# EasyEDA Pro project ProPrj_ESP32SoundBoard_2026-02-01.epro, board ESP32SoundBoard_1
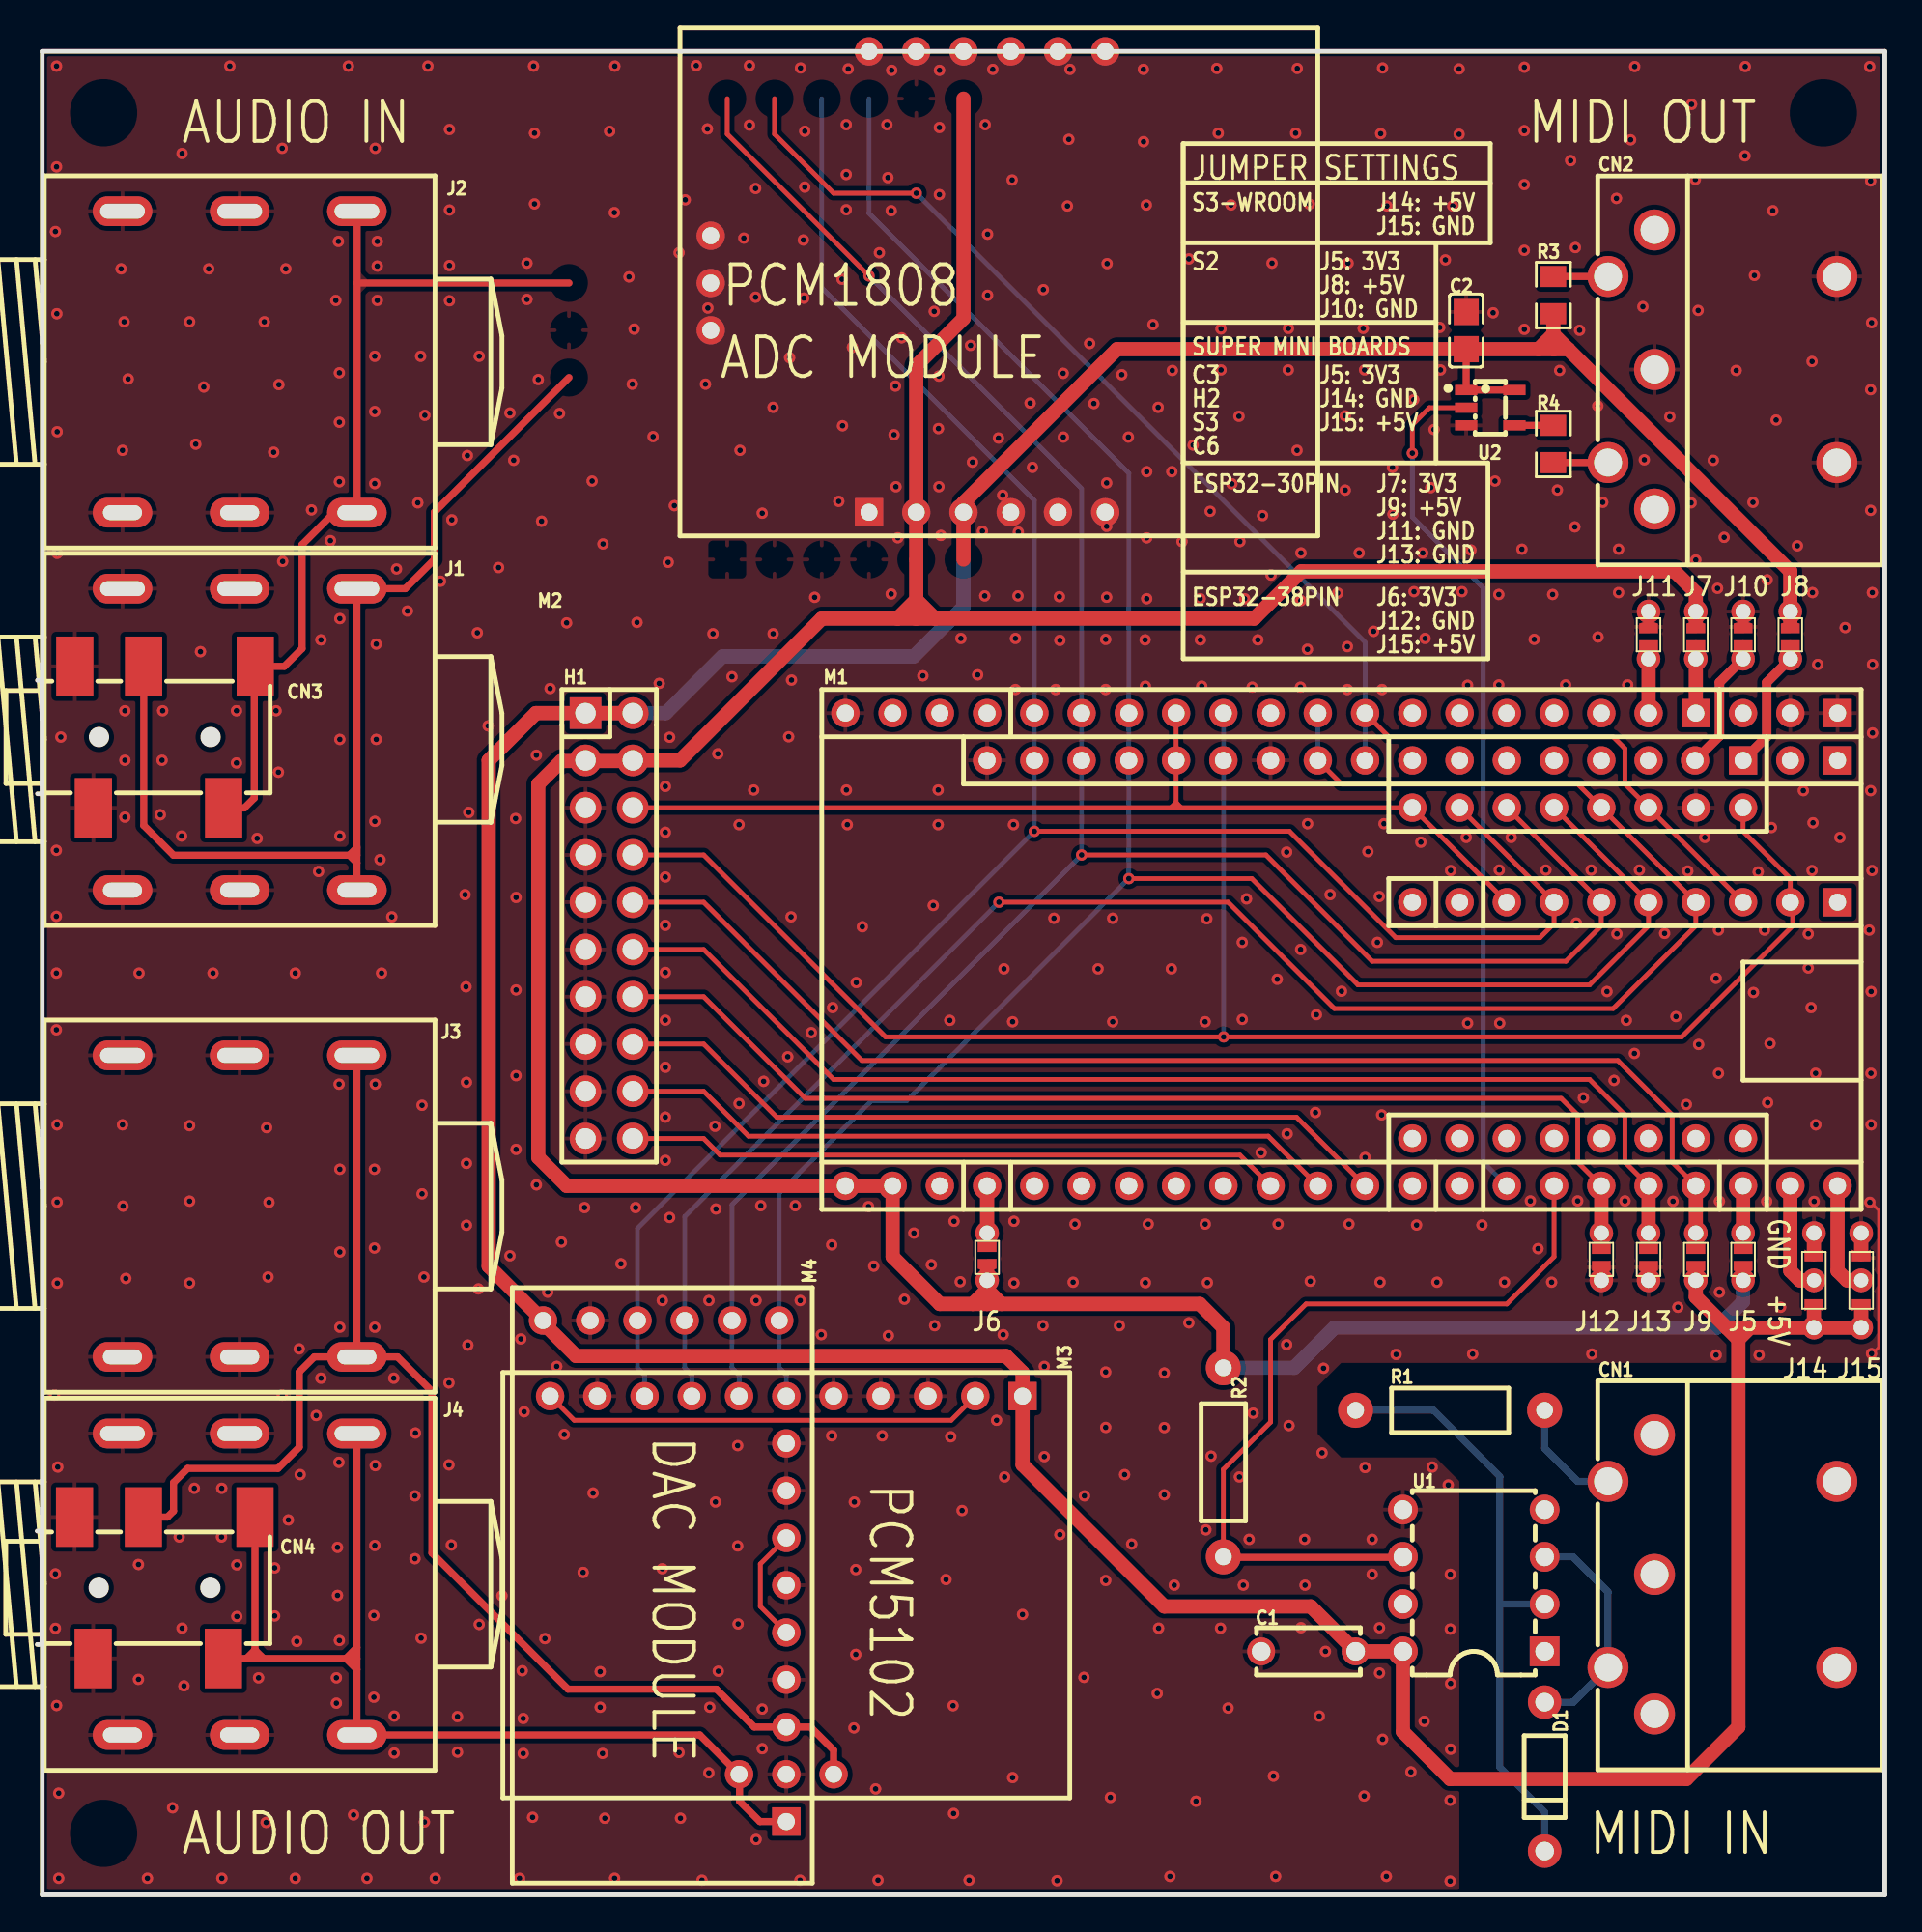
[diagram p6: board, top side]
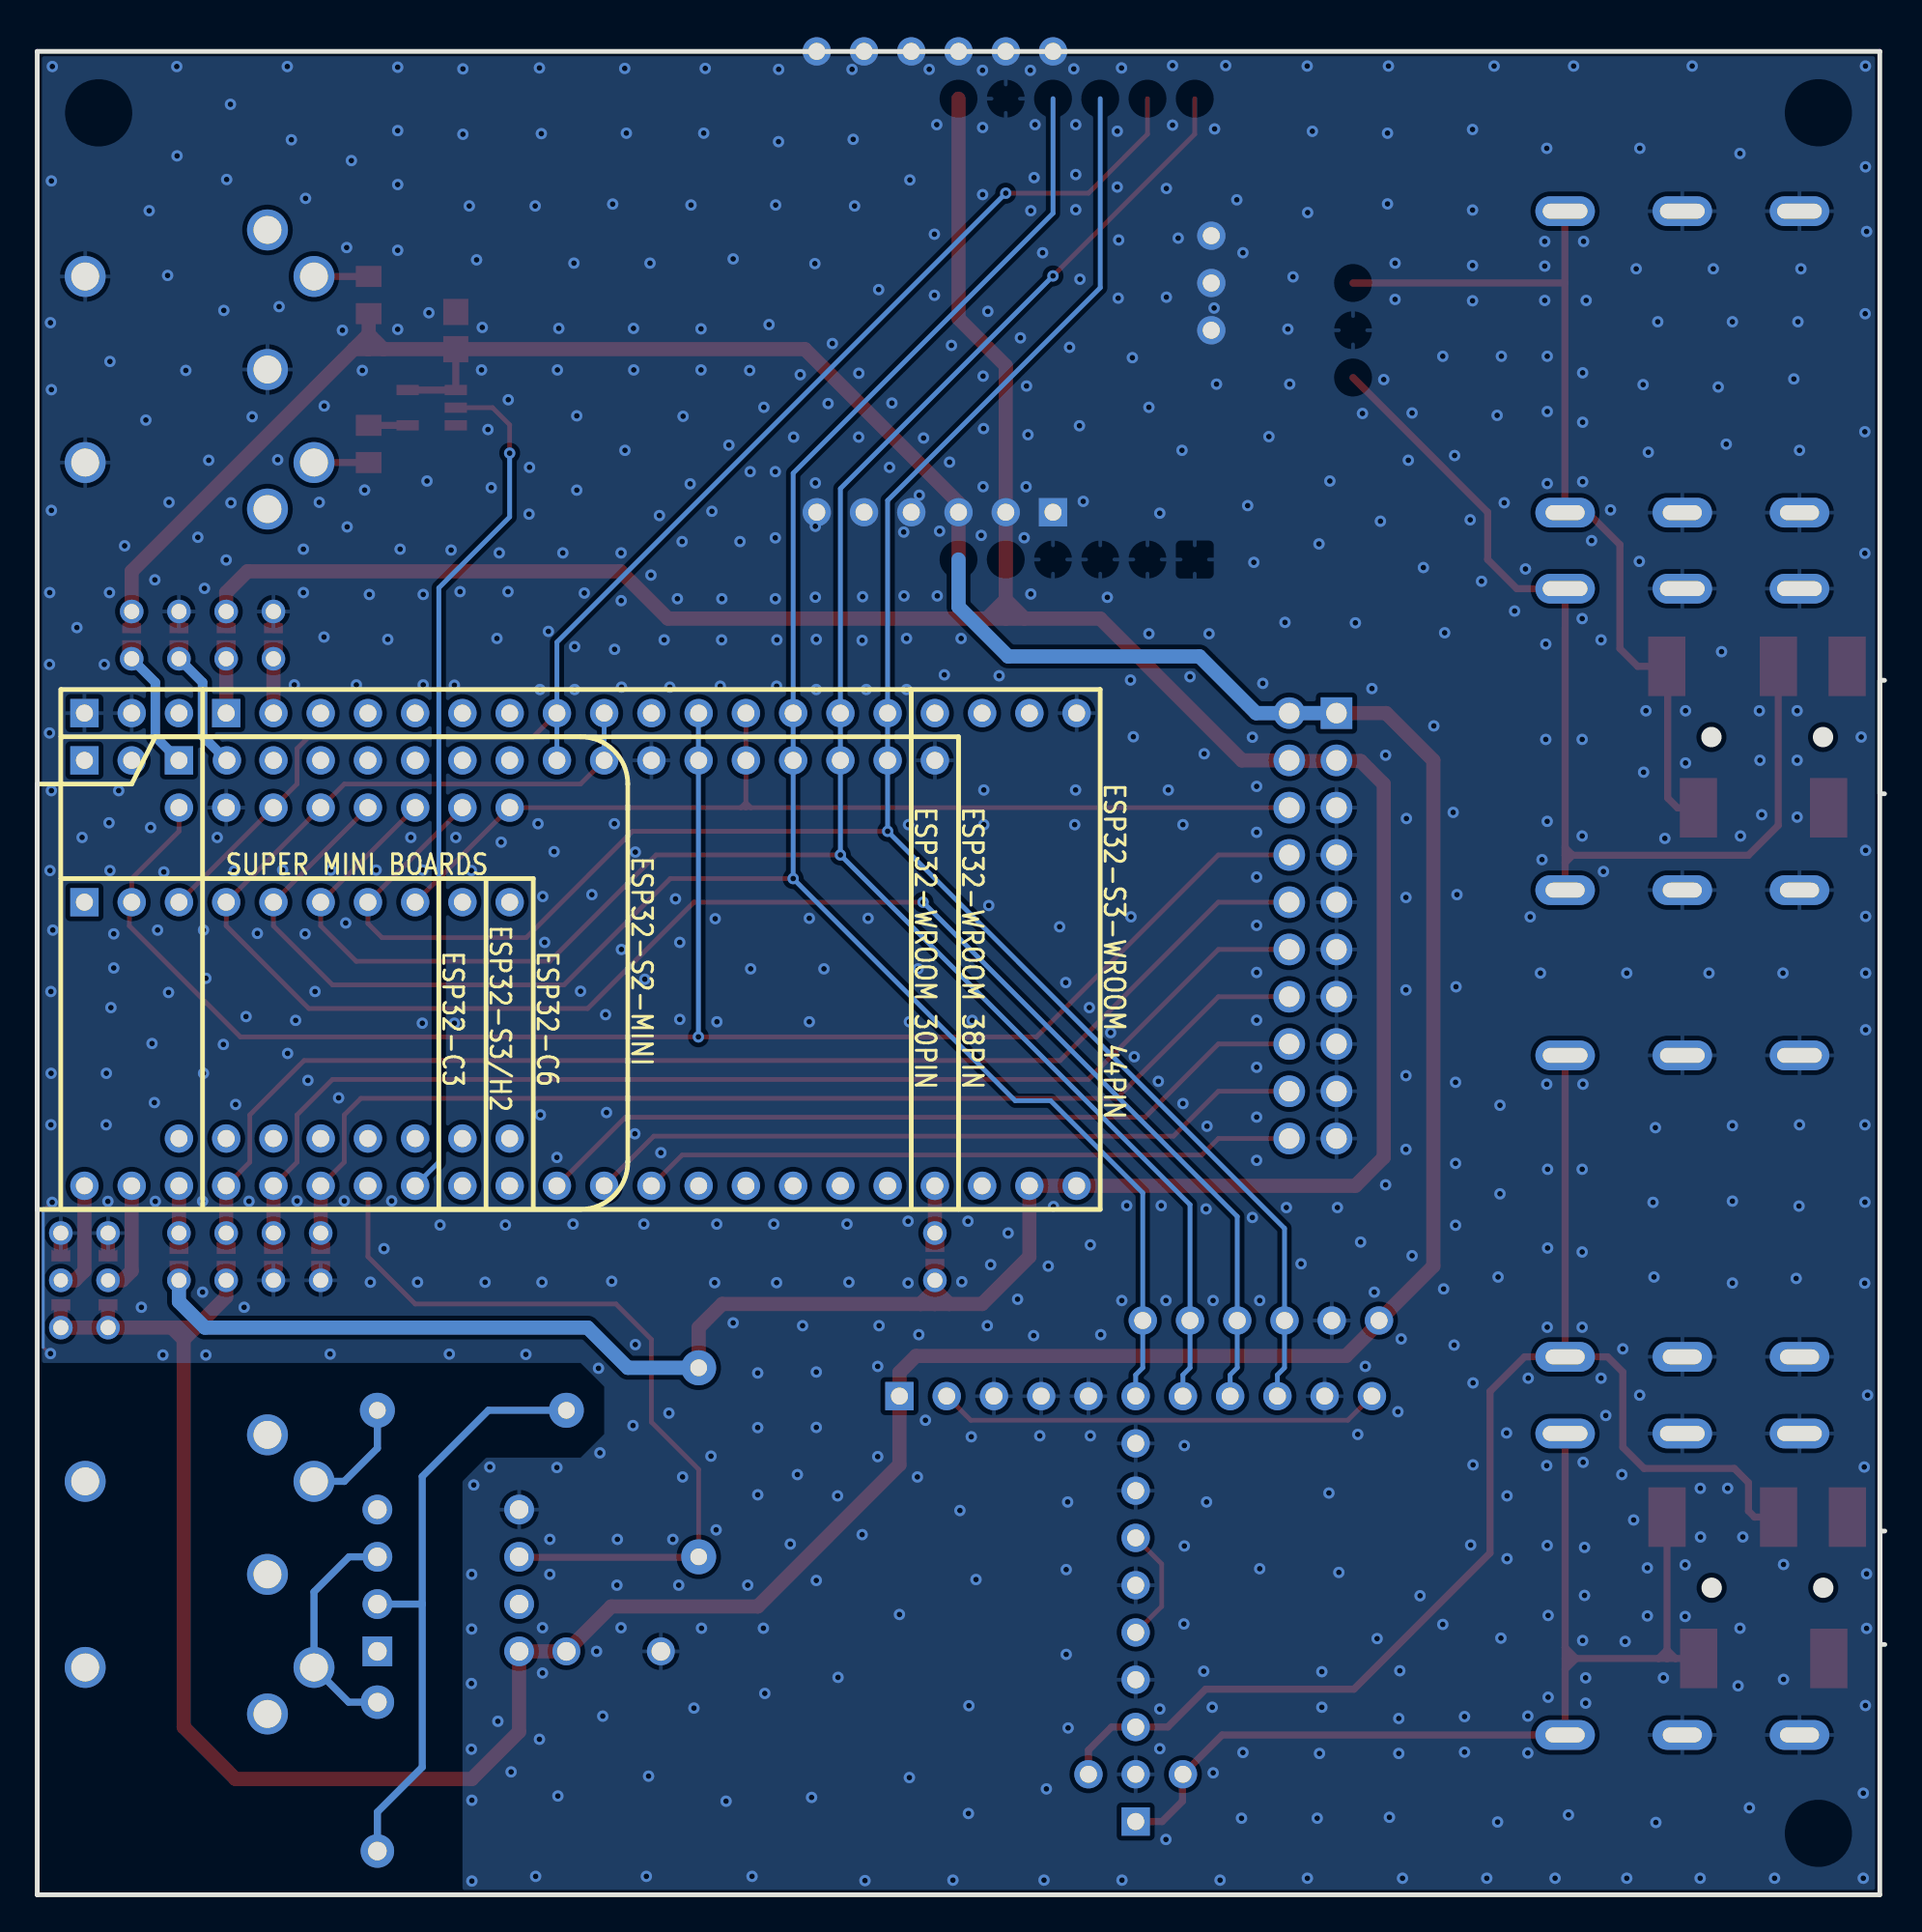
[diagram p7: board, bottom side, seen from below]

Outline 99.33 x 99.06 mm; copper layers: Top Layer, Bottom Layer. Coordinates in mm from the lower left corner of the outline.
Outline path: 0.27,99.06 99.33,99.06 99.33,0 0.27,0 0.27,99.06
Stack: Top Layer 0.035mm / Dielectric1 1.51mm FR4 er 4.5 / Bottom Layer 0.035mm

## Design rules (mm)
template: Custom Config
spacing copperThickness1oz (default): track to track 0.152, other pairs 0.152 to 0.3
spacing copperThickness2oz: track to track 0.203, other pairs 0.152 to 0.3
track width copperThickness1oz (default): min 0.127, default 0.254, max 2.54
track width copperThickness2oz: min 0.203, default 0.254, max 2.54
differential pair differentialPair (default): width min 0.127, default 0.254, max 2.54; gap min 0.152, default 0.152
via viaSize (default): diameter min 0.5, default 0.61, max 10; hole min 0.3, default 0.305, max 6.3

## Placement (name value [footprint] x y rotation side)
C1  100nF  [CAP-TH_L5.5-W2.4-P5.08-D0.6]  68.34 13.08 0 top
C2  100nF  [C0805]  76.82 84.06 90 top
CN1  DIN-504B-M10  [CONN-TH_DIN-504B-M10]  90.6 17.22 90 top
CN2  DIN-504B-M10  [CONN-TH_DIN-504B-M10]  90.6 81.97 90 top
CN3  PJ-327A 5JJ  [AUDIO-SMD_PJ-327A5JJ]  6.87 62.22 90 top
CN4  PJ-327A 5JJ  [AUDIO-SMD_PJ-327A5JJ]  6.86 16.5 90 top
D1  1N4148  [DO-35_BD2.0-L4.0-P8.00-D0.5-FD]  81.04 6.35 270 top
H1  -  [HDR-TH_20P-P2.54-V-M-R2-C10-S2.54]  30.75 52.07 270 top
J1  PJ-609  [AUDIO-TH_PJ-609]  10.89 62.09 0 top
J2  PJ-609  [AUDIO-TH_PJ-609]  10.89 82.37 0 top
J3  PJ-609  [AUDIO-TH_PJ-609]  10.89 37.01 0 top
J4  PJ-609  [AUDIO-TH_PJ-609]  10.89 16.69 0 top
J5  -  [Solder jumper]  91.71 34.69 270 top
J6  -  [Solder jumper]  51.07 34.8 270 top
J7  -  [Solder jumper]  89.17 67.16 90 top
J8  -  [Solder jumper]  94.25 67.16 90 top
J9  -  [Solder jumper]  89.17 34.69 270 top
J10  -  [Solder jumper]  91.71 67.16 90 top
J11  -  [Solder jumper]  86.63 67.16 90 top
J12  -  [Solder jumper]  84.09 34.69 270 top
J13  -  [Solder jumper]  86.63 34.69 270 top
J14  -  [Solder jumper 3 way]  95.52 33.02 90 top
J15  -  [Solder jumper 3 way]  98.06 33.02 90 top
M1  -  [ESP32_DEV_BOARD_MIX]  96.79 63.5 270 top
M2  PCM1808  [PCM1808_ADC_MODULE]  37.1 71.75 90 top
M3  PCM5102  [WCMCU-5102]  52.97 26.8 270 top
M4  PCM5102  [PCM5102_MODULE]  40.27 3.94 180 top
NOREF  -  [Pad_e221]  91.71 68.96 0 top
NOREF#2  -  [Pad_e224]  91.71 66.42 0 top
NOREF#3  -  [Pad_e3]  98.06 35.56 0 top
NOREF#4  -  [Pad_e219]  86.63 68.96 0 top
NOREF#5  -  [Pad_e86]  86.63 33.02 0 top
NOREF#6  -  [Pad_e77]  95.52 33.02 0 top
NOREF#7  -  [Pad_e213]  89.17 66.42 0 top
NOREF#8  -  [Pad_e68]  95.52 30.48 0 top
NOREF#9  -  [Pad_e94]  91.71 35.56 0 top
NOREF#10  -  [Pad_e223]  94.25 66.42 0 top
NOREF#11  -  [Pad_e84]  91.71 33.02 0 top
NOREF#12  -  [Pad_e222]  89.17 68.96 0 top
NOREF#13  -  [Pad_e28]  98.06 33.02 0 top
NOREF#14  -  [Pad_e96]  86.63 35.56 0 top
NOREF#15  -  [Pad_e89]  51.07 35.56 0 top
NOREF#16  -  [Pad_e218]  94.25 68.96 0 top
NOREF#17  -  [Pad_e93]  89.17 35.56 0 top
NOREF#18  -  [Pad_e85]  89.17 33.02 0 top
NOREF#19  -  [Pad_e87]  84.09 33.02 0 top
NOREF#20  -  [Pad_e88]  51.07 33.02 0 top
NOREF#21  -  [Pad_e220]  86.63 66.42 0 top
NOREF#22  -  [Pad_e44]  98.06 30.48 0 top
NOREF#23  -  [Pad_e66]  95.52 35.56 0 top
NOREF#24  -  [Pad_e95]  84.09 35.56 0 top
R1  10kΩ  [R_AXIAL-0.4]  75.96 26.03 0 top
R2  10kΩ  [R_AXIAL-0.4]  63.77 23.24 90 top
R3  10kΩ  [R0805]  81.51 85.96 90 top
R4  10kΩ  [R0805]  81.51 77.96 270 top
U1  6N139  [DIP-8_L9.6-W6.4-P2.54-LS7.9-BL]  77.23 16.89 90 top
U2  74LVC1G126GV  [SOT-753_L3.1-W1.7-P0.95-LS3.0-BR]  78.12 79.91 180 top

## Footprints (pads in the part's own frame, mm; a bottom-side part is the same pattern mirrored in y, then rotated)
AUDIO-SMD_PJ-327A5JJ
  rect 3.2x2 smd: 1(3.8,4.85) 2(-3.8,3.85) 3(3.8,1.15) 4(-3.8,-3.15) 5(3.8,-4.85)
AUDIO-TH_PJ-609
  oval 3.2x1.6 hole 2.1x0.8: 2(-6.3,-8.1) 4(0,-8.1) 6(6.3,-8.1)
  oval 3.2x1.6 hole 2.4x0.8: 3(-6.3,8.1) 5(0,8.1) 7(6.3,8.1)
C0805
  rect 1.41x1.35 smd: 1(-1,0) 2(1,0)
CAP-TH_L5.5-W2.4-P5.08-D0.6
  round 1.5 hole 1: 1(-2.54,0) 2(2.54,0)
CONN-TH_DIN-504B-M10
  round 2.2 hole 1.5: 1(-7.5,3.65) 2(-5,6.15) 3(0,3.65) 4(5,6.15) 5(7.5,3.65) 6(-5,-6.15) 7(5,-6.15)
DIP-8_L9.6-W6.4-P2.54-LS7.9-BL
  rect 1.6x1.6 hole 1: 1(-3.81,-3.81)
  round 1.6 hole 1: 2(-1.27,-3.81) 3(1.27,-3.81) 4(3.81,-3.81) 5(3.81,3.81) 6(1.27,3.81) 7(-1.27,3.81) 8(-3.81,3.81)
DO-35_BD2.0-L4.0-P8.00-D0.5-FD
  round 1.8 hole 1: 1(-4,0) 2(4,0)
ESP32_DEV_BOARD_MIX
  rect 1.524x1.524 hole 0.914: 1(0,0) 4(0,-7.62) 45(2.54,0) 47(2.54,-5.08) 72(10.16,0)
  round 1.524 hole 0.914: 2(0,-2.54) 3(0,-5.08) 5(0,-10.16) 6(0,-12.7) 7(0,-15.24) 8(0,-17.78) 9(0,-20.32) 10(0,-22.86) 11(0,-25.4) 12(0,-27.94) 13(0,-30.48) 14(0,-33.02) 15(0,-35.56) 16(0,-38.1) 17(0,-40.64) 18(0,-43.18) 19(0,-45.72) 20(0,-48.26) 21(0,-50.8) 22(0,-53.34) 23(25.4,-53.34) 24(25.4,-50.8) 25(25.4,-48.26) 26(25.4,-45.72) 27(25.4,-43.18) 28(25.4,-40.64) 29(25.4,-38.1) 30(25.4,-35.56) 31(25.4,-33.02) 32(25.4,-30.48) 33(25.4,-27.94) 34(25.4,-25.4) 35(25.4,-22.86) 36(25.4,-20.32) 37(25.4,-17.78) 38(25.4,-15.24) 39(25.4,-12.7) 40(25.4,-10.16) 41(25.4,-7.62) 42(25.4,-5.08) 43(25.4,-2.54) 44(25.4,0) 46(2.54,-2.54) 48(2.54,-7.66) 49(2.54,-10.16) 50(2.54,-12.7) 51(2.54,-15.24) 52(2.54,-17.78) 53(2.54,-20.32) 54(2.54,-22.86) 55(2.54,-25.4) 56(2.54,-27.94) 57(2.54,-30.48) 58(2.54,-33.02) 59(2.54,-35.56) 60(2.54,-38.1) 61(2.54,-40.64) 62(2.54,-43.18) 63(2.54,-45.72) 64(5.08,-5.08) 65(5.08,-7.62) 66(5.08,-10.16) 67(5.08,-12.7) 68(5.08,-15.24) 69(5.08,-17.78) 70(5.08,-20.32) 71(5.08,-22.86) 73(10.16,-2.54) 74(10.16,-5.08) 75(10.16,-7.62) 76(10.16,-10.16) 77(10.16,-12.7) 78(10.16,-15.24) 79(10.16,-17.78) 80(10.16,-20.32) 81(10.16,-22.86) 82(22.86,-22.86) 83(22.86,-20.32) 84(22.86,-17.78) 85(22.86,-15.24) 86(22.86,-12.7) 87(22.86,-10.16) 88(22.86,-7.62) 89(22.86,-5.08)
HDR-TH_20P-P2.54-V-M-R2-C10-S2.54
  rect 1.7x1.7 hole 1.1: 1(-11.43,-1.27)
  round 1.7 hole 1.1: 2(-11.43,1.27) 3(-8.89,-1.27) 4(-8.89,1.27) 5(-6.35,-1.27) 6(-6.35,1.27) 7(-3.81,-1.27) 8(-3.81,1.27) 9(-1.27,-1.27) 10(-1.27,1.27) 11(1.27,-1.27) 12(1.27,1.27) 13(3.81,-1.27) 14(3.81,1.27) 15(6.35,-1.27) 16(6.35,1.27) 17(8.89,-1.27) 18(8.89,1.27) 19(11.43,-1.27) 20(11.43,1.27)
Pad_e3
  round 1.27 hole 0.813: 1(0,0)
Pad_e28
  round 1.27 hole 0.762: 2(0,0)
Pad_e44
  round 1.27 hole 0.813: 3(0,0)
Pad_e66
  round 1.27 hole 0.813: 1(0,0)
Pad_e68
  round 1.27 hole 0.813: 3(0,0)
Pad_e77
  round 1.27 hole 0.762: 2(0,0)
Pad_e84
  round 1.27 hole 0.813: 1(0,0)
Pad_e85
  round 1.27 hole 0.813: 1(0,0)
Pad_e86
  round 1.27 hole 0.813: 1(0,0)
Pad_e87
  round 1.27 hole 0.813: 1(0,0)
Pad_e88
  round 1.27 hole 0.813: 1(0,0)
Pad_e89
  round 1.27 hole 0.813: 1(0,0)
Pad_e93
  round 1.27 hole 0.813: 1(0,0)
Pad_e94
  round 1.27 hole 0.813: 1(0,0)
Pad_e95
  round 1.27 hole 0.813: 1(0,0)
Pad_e96
  round 1.27 hole 0.813: 1(0,0)
Pad_e213
  round 1.27 hole 0.813: 1(0,0)
Pad_e218
  round 1.27 hole 0.813: 1(0,0)
Pad_e219
  round 1.27 hole 0.813: 1(0,0)
Pad_e220
  round 1.27 hole 0.813: 1(0,0)
Pad_e221
  round 1.27 hole 0.813: 1(0,0)
Pad_e222
  round 1.27 hole 0.813: 1(0,0)
Pad_e223
  round 1.27 hole 0.813: 1(0,0)
Pad_e224
  round 1.27 hole 0.813: 1(0,0)
PCM1808_ADC_MODULE
  rect 1.524x1.524 hole 0.914: 1(2.54,-7.62)
  round 1.524 hole 0.914: 2(2.54,-10.16) 3(2.54,-12.7) 4(2.54,-15.24) 5(2.54,-17.78) 6(2.54,-20.32) 7(27.305,-20.32) 8(27.305,-17.78) 9(27.305,-15.24) 10(27.305,-12.7) 11(27.305,-10.16) 12(27.305,-7.62) 13(17.399,0.889) 14(14.859,0.889) 15(12.319,0.889)
PCM5102_MODULE
  rect 1.524x1.524 hole 0.914: 1(0,0)
  round 1.524 hole 0.914: 3(0,-5.08) 4(0,-7.62) 5(0,-10.16) 6(0,-12.7) 7(0,-15.24) 8(0,-17.78) 9(0,-20.32) 10(0.381,-26.924) 11(2.921,-26.924) 12(5.461,-26.924) 13(8.001,-26.924) 14(10.541,-26.924) 15(13.081,-26.924)
R0805
  rect 1.133x1.377 smd: 1(-1,0) 2(1,0)
R_AXIAL-0.4
  round 1.879 hole 0.899: 1(-5.08,0) 2(5.08,0)
Solder jumper
  custom 0.635x1.016 smd: 1(0.021,0)
  custom 0.692x1.016 smd: 2(0.973,0)
Solder jumper 3 way
  custom 0.635x1.016 smd: 1(-1.206,0) 3(1.206,0)
  custom 1.27x1.016 smd: 2(0,0)
SOT-753_L3.1-W1.7-P0.95-LS3.0-BR
  rect 1.199x0.551 smd: 1(1.296,-0.95) 2(1.296,0) 3(1.296,0.95) 4(-1.296,0.95) 5(-1.296,-0.95)
WCMCU-5102
  rect 1.524x1.524 hole 0.914: 1(0,0)
  round 1.524 hole 0.914: 2(0,-2.54) 3(0,-5.08) 4(0,-7.62) 5(0,-10.16) 6(0,-12.7) 7(0,-15.24) 8(0,-17.78) 9(0,-20.32) 10(0,-22.86) 11(0,-25.4) 12(20.32,-15.24) 13(20.32,-12.7) 14(20.32,-10.16)

## Nets
3V3: H1.3 H1.4 J5.2 J6.2 J7.2 M1.23 M1.24 M2.5 M2.7 NOREF#11.1 NOREF#12.1 NOREF#20.1 R2.2
+5V: C1.2 C2.1 H1.1 H1.2 J8.2 J9.2 J14.1 J15.1 M2.6 M3.1 M4.15 NOREF#8.3 NOREF#16.1 NOREF#18.1 NOREF#22.3 R3.1 U1.8 U2.1 U2.5
GND: C1.1 C2.2 CN2.3 CN2.6 CN2.7 CN3.1 CN3.2 CN4.1 CN4.2 H1.5 H1.7 H1.9 H1.11 H1.13 H1.15 H1.17 H1.19 J1.2 J1.3 J1.4 J1.5 J2.2 J2.3 J2.4 J2.5 J3.2 J3.3 J3.4 J3.5 J4.2 J4.3 J4.4 J4.5 J10.2 J11.2 J12.2 J13.2 J14.3 J15.3 M1.1 M1.2 M1.22 M1.57 M1.63 M1.65 M2.1 M2.2 M2.3 M2.4 M2.8 M2.14 M3.3 M3.4 M3.5 M3.10 M3.13 M4.4 M4.6 M4.8 M4.9 M4.14 NOREF.1 NOREF#3.1 NOREF#4.1 NOREF#5.1 NOREF#19.1 NOREF#23.1 U1.5 U2.3
AOL: CN4.4 CN4.5 J4.6 J4.7 M3.12 M4.1
AOR: CN4.3 J3.6 J3.7 M3.14 M4.3
I2C1_SCL: H1.12 J13.1 M1.40 NOREF#14.1
I2C1_SDA: H1.14 J12.1 M1.39 NOREF#24.1
I2C2_SCL: H1.18 M1.33
I2C2_SDA: H1.20 M1.32
I2S_BCLK: M1.17 M1.61 M1.69 M1.77 M2.12 M3.7 M4.11
I2S_LRCK: M1.18 M1.62 M1.70 M1.78 M2.10 M3.9 M4.13
I2S_MCLK: M1.16 M1.60 M1.68 M1.76 M2.9 M3.6 M4.10
I2S_SDI: M1.11 M1.55 M1.66 M1.74 M2.11
I2S_SDO: M1.12 M1.56 M1.67 M1.75 M3.8 M4.12
INT1: H1.10 J9.1 M1.41 NOREF#17.1
INT2: H1.16 M1.34
MIDI_RX: M1.38 R2.1 U1.6
MIDI_TX: M1.37 U2.2
SPARE1: H1.6 M1.15 M1.59 M1.71 M1.79
SPARE2: H1.8 M1.14 M1.58 M1.64 M1.73
$1N8448: D1.2 R1.1 U1.2
$1N8617: R4.1 U2.4
$1N9304: CN1.4 R1.2
$1N9313: CN1.2 D1.1 U1.3
$1N9335: CN2.4 R3.2
$1N9340: CN2.2 R4.2
$1N10058: M3.2 M3.11
$1N10064: M4.5 M4.7
$1N10608: CN3.3 J1.6 J1.7 M2.15
$1N10635: CN3.4 CN3.5 J2.6 J2.7 M2.13
$1N57894: J7.1 M1.4 NOREF#7.1
$1N57899: J6.1 M1.26 NOREF#15.1
$1N57905: J5.1 M1.42 NOREF#9.1
$1N58212: J8.1 M1.47 NOREF#10.1
$1N58220: J15.2 M1.44 NOREF#13.2
$1N58226: J14.2 M1.43 NOREF#6.2
$1N59131: J11.1 M1.5 NOREF#21.1
$1N59137: J10.1 M1.48 NOREF#2.1

Pads without a net: CN1 1 3 5 6 7; CN2 1 5; M1 3 6 7 8 9 10 13 19 20 21 25 27 28 29 30 31 35 36 45 46 49 50 51 52 53 54 72 80 81 82 83 84 85 86 87 88 89; U1 1 4 7

## Via types
v1: diameter 0.61, hole 0.305, Top Layer to Bottom Layer, 719 vias

## Routing (per net, layer and track width the routed paths; a pad name or vN(x,y) marks a point on that pad's centre or on a via; arc(x,y) is an arc through that point)
3V3: length 201
  Top Layer w0.762: 51.07,31.75 50.29,31.75 ; 51.07,31.75 51.84,31.75 ; 51.07,31.75 51.07,32.52 ; 50.29,31.75 51.07,32.52 ; 50.29,31.75 48.53,31.75 45.99,34.29 M1.24 M1.23 28.46,38.1 26.94,39.62 26.94,59.69 28.17,60.93 31.98,60.93 H1.4 34.56,60.96 42.18,68.58 46.24,68.58 ; 63.77,28.32 63.77,30.48 62.5,31.75 51.84,31.75 ; 47.26,69.6 47.26,82.17 49.8,84.71 49.8,96.52 ; 47.26,69.6 47.26,68.61 47.23,68.58 ; 47.26,69.6 46.24,68.58 ; 47.26,69.6 48.27,68.58 ; 47.23,68.58 48.27,68.58 ; 47.23,68.58 46.24,68.58 ; 51.84,31.75 51.07,32.52 ; 89.17,68.4 89.17,69.98 88.03,71.12 67.96,71.12 65.42,68.58 48.27,68.58 ; 51.07,32.52 51.07,33.55 ; NOREF#11.1 91.71,33.55
  Bottom Layer w0.762: NOREF#11.1 91.71,31.88 90.31,30.48 69.74,30.48 67.58,28.32 63.77,28.32
+5V: length 250
  Top Layer w0.381: C2.1 U2.1 U2.5
  Top Layer w0.762: 82.31,83.06 81.51,83.86 ; 82.31,83.06 94.25,71.12 94.25,68.4 ; 82.31,83.06 81.53,83.06 ; 81.51,83.86 81.51,83.08 81.53,83.06 ; 81.51,83.86 80.71,83.06 ; 81.51,83.86 R3.1 ; NOREF#8.3 92.09,30.48 ; NOREF#8.3 95.52,31.62 ; NOREF#8.3 NOREF#22.3 98.06,31.62 ; 92.09,30.48 91.45,30.48 ; 92.09,30.48 91.45,29.84 ; 80.71,83.06 C2.1 58.05,83.06 49.8,74.8 49.8,71.75 ; 80.71,83.06 81.53,83.06 ; 90.82,30.48 89.17,32.13 NOREF#18.1 ; 90.82,30.48 91.45,30.48 ; 90.82,30.48 91.45,29.84 ; 91.45,29.84 91.45,9.02 88.66,6.22 75.96,6.22 73.42,8.76 U1.8 C1.2 68.47,15.49 60.59,15.49 52.97,23.11 M3.1 52.97,28.07 52.08,28.96 28.97,28.96 27.19,30.73 27.19,30.86 24.27,33.78 24.27,60.96 26.81,63.5 H1.1 H1.2 ; 91.45,29.84 91.45,30.48
  Bottom Layer w0.762: H1.1 H1.2 33.8,63.5 36.84,66.55 47.13,66.55 49.8,69.22 49.8,71.75
GND: length 18.1
  Top Layer w0.152: 98.67,29.08 99,29.42 99,36.78 98.57,37.21
  Top Layer w0.762: NOREF#23.1 95.52,34.42 ; NOREF#3.1 98.06,34.42
  Bottom Layer w0.152: 99,36.78 99,29.42
  vias: v1(0.98,89.38) v1(0.93,26.85) v1(0.98,17.25) v1(0.98,14.32) v1(1.04,98.27) v1(1.04,92.86) v1(1.06,84.96) v1(1.07,78.62) v1(1.07,72.09) v1(1.03,56.13) v1(1.03,52.58) v1(1.03,49.53) v1(1.03,46.48) v1(1.07,41.38) v1(1.07,37.22) v1(1.08,32.87) v1(1.11,22.99) v1(1.04,10.17) v1(1.16,5.46) v1(1.16,0.89) v1(1.27,62.22) v1(4.51,87.38) v1(4.59,77.62) v1(4.59,41.38) v1(4.61,37.01) v1(4.67,84.53) v1(4.71,63.63) v1(4.71,60.97) v1(4.71,57.91) v1(4.76,33.12) v1(4.89,81.46) v1(5.47,49.53) v1(5.44,17.75) v1(5.44,11.58) v1(5.93,0.89) v1(6.62,58.04) v1(6.71,60.97) v1(6.75,63.63) v1(7.28,4.67) v1(7.63,19.23) v1(7.79,93.57) v1(7.76,56.9) v1(7.79,14.33) v1(7.89,11.23) v1(8.19,84.53) v1(8.19,41.33) v1(8.19,37.28) v1(8.19,32.87) v1(8.45,21.84) v1(8.52,77.95) v1(8.78,66.8) v1(8.95,81.03) v1(9.22,87.38) v1(9.45,49.53) v1(9.91,19.23) v1(9.92,21.84) v1(9.93,0.89) v1(10.36,98.27) v1(10.71,63.63) v1(10.71,60.82) v1(10.73,17.73) v1(10.73,14.96) v1(11.83,56.77) v1(11.9,11.66) v1(12.21,84.53) v1(12.31,3.89) v1(12.33,41.22) v1(12.41,33.2) v1(12.46,37.21) v1(12.71,77.52) v1(12.77,17.57) v1(12.77,14.99) v1(12.84,63.63) v1(12.99,81.15) v1(12.97,60.33) v1(13.17,93.85) v1(13.2,71.65) v1(13.18,26.85) v1(13.37,87.38) v1(13.5,20.14) v1(13.87,49.53) v1(13.87,0.89) v1(13.96,13.61) v1(14.09,29.34) v1(14.14,22.58) v1(14.75,74.42) v1(15,25.76) v1(15.13,54.99) v1(15.25,67.44) v1(15.25,27.76) v1(15.76,72.77) v1(16.05,85.68) v1(16.08,11.66) v1(16.08,10.3) v1(16.19,88.85) v1(16.14,18.67) v1(16.14,16.09) v1(16.24,81.79) v1(16.24,79.13) v1(16.24,75.94) v1(16.27,68.58) v1(16.27,62.09) v1(16.27,56.9) v1(16.23,43.56) v1(16.27,38.99) v1(16.27,34.54) v1(16.27,30.5) v1(16.22,23.24) v1(16.24,13.66) v1(16.73,98.27) v1(17.01,4.29) v1(17.73,0.89) v1(18.1,15.01) v1(18.1,10.62) v1(18.17,93.85) v1(18.15,82.68) v1(18.15,79.71) v1(18.15,75.84) v1(18.15,57.68) v1(18.17,43.56) v1(18.13,38.99) v1(18.13,34.76) v1(18.15,30.5) v1(18.17,23.06) v1(18.15,18.77) v1(18.28,88.85) v1(18.28,87.52) v1(18.28,85.68) v1(18.23,67.21) v1(18.23,62.09) v1(18.43,55.63) v1(18.51,49.53) v1(19.06,52.55) v1(19.17,27.76) v1(19.19,9.6) v1(19.19,7.62) v1(19.32,71.25) v1(19.9,68.99) v1(20.31,21.44) v1(20.31,18.06) v1(20.33,24.82) v1(20.46,74.8) v1(20.61,82.68) v1(20.69,42.43) v1(20.69,37.67) v1(20.64,13.79) v1(20.79,33.2) v1(20.82,3.91) v1(20.84,79.5) v1(21,98.27) v1(21.4,0.89) v1(21.68,70.59) v1(22.16,94.87) v1(22.16,90.54) v1(22.16,87.55) v1(22.16,85.66) v1(22.14,27.51) v1(22.14,23.1) v1(22.29,73.89) v1(22.26,18.8) v1(22.59,9.58) v1(22.59,7.67) v1(23,53.75) v1(23.05,48.79) v1(23.08,43.66) v1(23.08,39.3) v1(23.08,35.98) v1(23.13,77.34) v1(23.2,58.17) v1(23.15,29.54) v1(23.66,67.82) v1(23.76,82.68) v1(23.72,32.56) v1(23.76,14.53) v1(24.25,62.81) v1(24.8,71.32) v1(24.99,16.07) v1(25.41,79.63) v1(25.41,34.34) v1(25.62,77.09) v1(25.72,57.84) v1(25.74,53.6) v1(25.74,48.62) v1(25.74,44.02) v1(25.74,40.06) v1(26,29.87) v1(25.93,0.89) v1(26.07,12.04) v1(26.18,25.96) v1(26.13,9.48) v1(26.13,7.59) v1(26.33,87.68) v1(26.33,85.73) v1(26.68,98.27) v1(26.63,4.17) v1(26.73,94.67) v1(26.73,90.87) v1(26.84,61.24) v1(26.84,38.15) v1(26.94,81.42) v1(27.12,73.81) v1(27.29,13.77) v1(27.45,32.39) v1(27.57,64.82) v1(27.93,28.4) v1(28.08,79.6) v1(28.18,35.08) v1(28.34,24.74) v1(28.46,68.35) v1(29.35,17.32) v1(29.43,36.93) v1(29.83,75.97) v1(29.88,21.59) v1(30.27,11.99) v1(30.27,10.08) v1(30.39,7.59) v1(30.42,72.59) v1(30.51,4.12) v1(30.77,94.77) v1(31.05,98.27) v1(31.03,90.4) v1(31.04,0.89) v1(31.38,33.91) v1(31.81,86.94) v1(31.99,81.18) v1(32.09,84.14) v1(32.17,36.93) v1(32.25,68.38) v1(33.11,78.36) v1(33.44,65.1) v1(33.61,31.94) v1(33.61,17.52) v1(33.77,59.56) v1(33.77,57.1) v1(33.77,54.69) v1(33.77,52.1) v1(33.77,49.56) v1(33.77,47) v1(33.77,44.47) v1(33.77,41.79) v1(33.77,39.47) v1(33.92,71.6) v1(34,62.2) v1(34,36.4) v1(34.25,74.65) v1(34.51,88.24) v1(34.51,7.65) v1(34.58,4.12) v1(34.84,91.08) v1(35.43,98.3) v1(35.74,0.79) v1(35.93,81.18) v1(36.03,94.89) v1(36.06,85.27) v1(36.11,31.94) v1(36.11,6.55) v1(36.16,10.08) v1(36.33,67.77) v1(36.44,41.3) v1(36.49,36.86) v1(36.46,21.11) v1(36.59,61.32) v1(36.62,12.01) v1(37.35,65.46) v1(37.66,24.14) v1(37.66,18.75) v1(37.68,14.55) v1(37.78,77.62) v1(37.73,57.51) v1(37.73,42.52) v1(37.99,89.03) v1(38.29,98.3) v1(38.29,95.1) v1(38.52,59.37) v1(38.62,91.69) v1(38.62,85.85) v1(38.65,31.94) v1(38.65,2.97) v1(38.9,37.03) v1(38.98,74.24) v1(38.98,9.98) v1(38.98,7.85) v1(39.05,43.71) v1(39.56,79.93) v1(39.56,67.77) v1(40.4,62.23) v1(40.35,45.03) v1(40.45,82.6) v1(40.55,65.28) v1(40.53,52.55) v1(40.76,37.03) v1(41.01,0.79) v1(41.03,98.17) v1(41.02,31.94) v1(41.19,88.93) v1(41.21,85.8) v1(41.26,94.77) v1(41.26,91.77) v1(41.62,46.33) v1(41.8,69.72) v1(42.15,30.1) v1(42.71,34.92) v1(42.71,24.66) v1(42.76,47.68) v1(43.09,74.88) v1(43.27,86.82) v1(43.3,78.94) v1(43.49,95.12) v1(43.49,92.44) v1(43.49,90.55) v1(43.5,59.37) v1(43.6,98.12) v1(43.55,57.51) v1(43.83,83.16) v1(43.91,8.97) v1(43.93,21.11) v1(44.01,17.47) v1(44.01,12.92) v1(44.03,49.02) v1(44.36,52.02) v1(44.69,36.98) v1(44.97,33.78) v1(45.07,5.69) v1(45.2,0.79) v1(45.28,88.24) v1(45.43,24.66) v1(45.68,95.12) v1(45.73,92.28) v1(45.76,30.05) v1(45.91,90.5) v1(45.91,69.9) v1(45.94,98.04) v1(46.06,78.46) v1(46.14,81.08) v1(46.17,75.67) v1(46.27,72.92) v1(46.47,83.67) v1(46.62,32) v1(47.13,35.56) v1(47.61,65.51) v1(48.07,33.86) v1(48.17,53.16) v1(48.22,85.09) v1(48.25,30.58) v1(48.51,98.04) v1(48.5,94.97) v1(48.5,91.36) v1(48.48,81.61) v1(48.45,78.79) v1(48.48,75.67) v1(48.44,59.37) v1(48.44,57.51) v1(48.58,73.05) v1(48.86,16.94) v1(49.06,46.99) v1(49.11,24.61) v1(49.29,36.2) v1(49.24,10.16) v1(49.26,4.37) v1(49.66,67.51) v1(49.62,32.94) v1(49.72,20.65) v1(50.1,0.79) v1(50.18,83.26) v1(50.28,76.99) v1(50.56,65.56) v1(50.81,73.28) v1(50.97,95.12) v1(50.94,69.8) v1(51.09,89.24) v1(51.09,85.95) v1(51.37,98.09) v1(51.58,25.5) v1(51.68,78.28) v1(51.91,75.21) v1(51.97,49.76) v1(51.93,30.1) v1(52.01,22.45) v1(52.41,92.15) v1(52.49,57.51) v1(52.44,46.91) v1(52.51,36.2) v1(52.51,32.88) v1(52.44,6.3) v1(52.59,67.51) v1(52.59,64.77) v1(52.74,73.23) v1(52.73,69.8) v1(52.97,15.06) v1(53.38,80.16) v1(53.51,76.71) v1(54.09,86.26) v1(54.07,30.58) v1(54.14,28.4) v1(54.14,23.55) v1(54.66,52.48) v1(54.75,64.77) v1(54.83,0.76) v1(54.95,74.14) v1(54.95,69.76) v1(54.98,67.41) v1(54.98,19.35) v1(55.16,81.76) v1(55.17,78.33) v1(55.39,90.75) v1(55.46,94.34) v1(55.52,98.09) v1(55.69,32.92) v1(55.79,36.04) v1(56.3,21.44) v1(56.28,11.68) v1(56.58,83.36) v1(56.81,80.14) v1(57.03,49.76) v1(57.49,75.87) v1(57.49,73.54) v1(57.49,69.73) v1(57.44,67.46) v1(57.44,64.77) v1(57.44,28.09) v1(57.44,25.12) v1(57.44,16.89) v1(57.52,87.66) v1(57.7,5.23) v1(57.82,52.48) v1(57.82,46.91) v1(58.18,30.58) v1(58.31,81.69) v1(58.46,22.58) v1(58.66,78.33) v1(58.84,18.85) v1(59.47,98.09) v1(59.48,94.21) v1(59.56,67.44) v1(59.58,64.95) v1(59.58,32.89) v1(59.63,90.81) v1(59.65,76.48) v1(59.65,72.92) v1(59.65,69.65) v1(59.73,36.04) v1(59.98,84.38) v1(60.21,10.82) v1(60.26,79.93) v1(60.29,14.33) v1(60.59,28.04) v1(60.59,25.11) v1(60.59,21.49) v1(60.9,0.99) v1(61,76.48) v1(60.97,49.76) v1(61.03,81.92) v1(61.13,16.64) v1(61.55,72.72) v1(61.91,87.91) v1(61.91,30.73) v1(62.14,77.9) v1(62.29,5.03) v1(62.52,69.65) v1(62.53,67.44) v1(62.61,64.95) v1(62.79,46.91) v1(62.79,36.04) v1(62.88,52.45) v1(62.91,32.89) v1(62.83,19.61) v1(63.06,74.35) v1(63.11,23.57) v1(63.41,98.15) v1(63.5,94.67) v1(63.62,14.33) v1(63.64,84.15) v1(63.64,81.94) v1(64.02,10.03) v1(64.18,90.81) v1(64.22,75.82) v1(64.61,79.45) v1(64.66,72.72) v1(64.63,22.45) v1(64.78,51.18) v1(64.78,47.04) v1(64.91,69.65) v1(64.84,16.64) v1(65.01,53.52) v1(65.16,19.1) v1(65.32,64.9) v1(65.37,25.88) v1(65.62,67.44) v1(65.8,39.88) v1(65.88,74.12) v1(66.38,87.68) v1(66.33,70.92) v1(66.46,6.38) v1(66.58,0.99) v1(66.66,49.2) v1(66.71,36.04) v1(67.17,56.03) v1(67.2,40.89) v1(67.17,29.57) v1(67.27,84.18) v1(67.26,81.94) v1(67.3,25.22) v1(67.65,94.67) v1(67.74,98.15) v1(67.73,77.62) v1(67.92,64.9) v1(67.94,72.11) v1(67.93,69.55) v1(67.92,50.8) v1(67.94,14.35) v1(68.14,19.1) v1(68.16,16.64) v1(68.29,66.93) v1(68.3,57.56) v1(68.39,90.86) v1(68.44,32.97) v1(68.77,47.3) v1(68.72,42.04) v1(68.92,9.6) v1(69.08,23.75) v1(69.15,28.3) v1(69.26,13.08) v1(69.51,53.75) v1(69.91,69.95) v1(70.12,48.55) v1(70.32,79.48) v1(70.32,75.48) v1(70.47,87.68) v1(70.44,67.07) v1(70.44,64.77) v1(70.52,36.04) v1(71.07,72.11) v1(71.29,84.18) v1(71.36,81.94) v1(71.39,39.62) v1(71.39,22.96) v1(71.34,5.31) v1(71.54,56.06) v1(71.77,19.1) v1(71.77,17.22) v1(71.84,67.89) v1(72.05,51.18) v1(72.15,53.64) v1(72.19,32.92) v1(72.16,14.35) v1(72.16,11.92) v1(72.23,94.64) v1(72.3,64.77) v1(72.28,41.91) v1(72.33,98.17) v1(72.4,57.56) v1(72.33,8.36) v1(72.56,90.75) v1(72.53,0.99) v1(72.86,76.71) v1(72.89,74.19) v1(73.06,29.04) v1(73.85,6.6) v1(74,80.34) v1(74.02,70.03) v1(74.16,35.99) v1(74.38,56.57) v1(74.49,72.11) v1(74.61,67.51) v1(74.56,9.32) v1(74.92,75.62) v1(75,22.99) v1(75.1,78.74) v1(75.25,32.92) v1(75.4,84.23) v1(75.44,81.94) v1(75.71,87.86) v1(75.86,22.02) v1(75.99,55.04) v1(75.97,17.22) v1(75.97,14.28) v1(75.99,11.35) v1(75.99,7.82) v1(75.96,5.08) v1(75.96,0.74) v1(76.1,90.75) v1(76.44,98.12) v1(76.44,94.61) v1(76.59,70.03) v1(76.9,65) v1(76.82,56.82) v1(76.9,46.84) v1(77.08,72.26) v1(77.17,29.06) v1(77.67,35.99) v1(78.27,85.01) v1(78.37,75.97) v1(78.58,69.88) v1(78.58,65.02) v1(78.6,55.07) v1(78.63,46.84) v1(78.88,32.92) v1(79.24,56.82) v1(79.82,72.31) v1(79.95,98.21) v1(79.95,94.8) v1(79.95,91.9) v1(79.95,88.37) v1(79.95,84.12) v1(80.27,37.29) v1(80.48,67.46) v1(80.68,34.72) v1(81.11,55.07) v1(81.42,32.92) v1(81.47,69.88) v1(81.73,75.49) v1(81.85,81.92) v1(82.17,65.02) v1(82.44,93.19) v1(82.69,88.52) v1(82.67,73.51) v1(82.74,52.22) v1(82.82,37.29) v1(82.92,84.07) v1(83.12,42.82) v1(83.54,55.07) v1(83.58,29.06) v1(83.9,80) v1(83.91,67.59) v1(84.16,74.83) v1(84.39,48.54) v1(84.77,43.76) v1(84.9,91.16) v1(84.93,51.64) v1(85.02,72.31) v1(85.02,69.98) v1(85.36,37.29) v1(85.51,65.02) v1(85.43,46.99) v1(85.66,94.31) v1(85.88,98.25) v1(85.87,45.21) v1(86.14,55.07) v1(86.32,85.34) v1(86.4,77.11) v1(87.49,51.66) v1(87.77,79.43) v1(87.94,37.27) v1(88.1,47.19) v1(88.2,31.57) v1(88.66,42.47) v1(88.74,55.02) v1(88.91,74.8) v1(88.94,96.22) v1(89.14,92.18) v1(89.17,71.73) v1(89.29,85.14) v1(89.32,45.69) v1(89.65,56.82) v1(90.11,77.09) v1(90.26,49.25) v1(90.26,29.01) v1(90.34,70.21) v1(90.39,51.84) v1(90.39,44.14) v1(90.44,37.27) v1(90.44,32.39) v1(90.69,72.95) v1(91.34,81.92) v1(91.81,93.45) v1(91.83,98.25) v1(92.32,87.02) v1(92.24,74.83) v1(92.27,48.49) v1(92.52,54.97) v1(92.57,29.01) v1(92.86,51.84) v1(93,70.66) v1(92.98,37.26) v1(93.03,42.57) v1(93.16,45.75) v1(93.31,90.5) v1(93.23,57.35) v1(93.49,79.25) v1(93.73,31.57) v1(94.63,72.49) v1(94.95,59.33) v1(95.21,51.64) v1(95.21,49.81) v1(95.42,82.4) v1(95.42,55.04) v1(95.37,47.68) v1(95.44,69.98) v1(95.47,57.61) v1(95.61,44.14) v1(95.53,37.26) v1(95.62,41.38) v1(95.72,66.12) v1(96.91,56.82) v1(97.19,68.1) v1(98.52,98.25) v1(98.49,51.84) v1(98.57,92.1) v1(98.62,84.48) v1(98.57,80.88) v1(98.57,74.4) v1(98.57,59.33) v1(98.59,48.54) v1(98.58,44.14) v1(98.59,41.38) v1(98.52,37.21) v1(98.62,29.08) v1(98.66,69.98) v1(98.67,66.12) v1(98.67,62.44) v1(98.64,55.04)
AOL: length 59.8
  Top Layer w0.381: J4.7 17.19,13.29 ; 17.19,13.29 17.19,12.69 ; 17.19,13.29 16.6,12.7 ; 12.17,12.7 11.7,12.7 ; 12.17,12.7 11.71,13.16 ; 12.17,12.7 16.6,12.7 ; 11.7,12.7 11.25,12.7 ; 11.7,12.7 11.71,12.7 11.71,13.16 ; 11.25,12.7 11.71,13.16 ; 11.25,12.7 CN4.4 ; 17.19,12.69 17.18,12.7 16.6,12.7 ; 17.19,12.69 17.19,12.11 ; 11.71,13.16 CN4.5 ; 17.19,12.11 J4.6 35.62,8.59 M3.12 37.76,6.45 37.76,5.03 38.85,3.94 M4.1 ; 17.19,12.11 16.6,12.7
AOR: length 75.3
  Top Layer w0.381: J3.6 19.37,28.91 21.22,27.05 21.22,18.36 28.54,11.05 36.51,11.05 38.55,9.02 41.57,9.02 42.81,7.77 42.81,6.48 ; J3.6 J3.7 ; J3.6 14.9,28.91 14.09,28.09 14.09,24.05 12.94,22.91 8.09,22.91 7.33,22.15 7.33,20.62 7,20.3 CN4.3
I2C1_SCL: length 64.6
  Top Layer w0.254: H1.12 35.83,50.8 42.81,43.81 83.45,43.81 85.36,41.91 85.36,39.37 M1.40
  Top Layer w0.762: 86.63,34.82 NOREF#14.1 M1.40
I2C1_SDA: length 61
  Top Layer w0.254: H1.14 35.83,48.26 41.29,42.8 81.93,42.8 82.82,41.91 82.82,39.37 M1.39
  Top Layer w0.762: M1.39 NOREF#24.1 84.09,34.82
I2C2_SCL: length 38.9
  Top Layer w0.254: M1.33 66.18,40.77 38.24,40.77 35.83,43.18 H1.18
I2C2_SDA: length 35.3
  Top Layer w0.254: H1.20 35.83,40.64 36.72,39.75 64.66,39.75 M1.32
I2S_BCLK: length 125.1
  Top Layer w0.254: 37.1,96.52 37.1,94.62 v1(44.72,87) ; v1(56.15,55.88) 66.05,55.88 71.77,50.17 82.18,50.17 84.09,52.07 M1.77 M1.69
  Bottom Layer w0.254: v1(44.72,87) 56.15,75.56 M1.17 M1.61 v1(56.15,55.88) 37.35,37.08 37.35,28.32 37.73,27.94 M3.7
I2S_LRCK: length 122.4
  Top Layer w0.254: v1(53.61,57.15) 67.32,57.15 73.04,51.44 80.79,51.44 81.55,52.2 M1.78 M1.70
  Bottom Layer w0.254: 42.18,96.52 42.18,86.36 53.61,74.93 M1.18 M1.62 v1(53.61,57.15) 32.27,35.81 32.27,28.32 32.65,27.94 32.65,26.8
I2S_MCLK: length 124.6
  Top Layer w0.254: v1(58.69,54.61) 65.29,54.61 71.01,48.89 83.45,48.89 86.63,52.07 M1.76 M1.68
  Bottom Layer w0.254: 40.27,26.8 40.27,27.94 39.89,28.32 39.89,37.72 44.84,42.67 46.75,42.67 v1(58.69,54.61) M1.60 M1.16 58.69,76.39 44.72,90.36 44.72,96.52
I2S_SDI: length 77
  Top Layer w0.254: M1.74 M1.66 85.36,59.69 85.36,61.59 84.72,62.23 72.66,62.23 M1.11 ; v1(47.26,91.44) 42.81,91.44 39.64,94.62 39.64,96.52
  Bottom Layer w0.254: v1(47.26,91.44) 71.39,67.31 M1.11 M1.55
I2S_SDO: length 102.7
  Top Layer w0.254: v1(51.7,53.34) 64.02,53.34 69.74,47.62 84.72,47.62 89.17,52.07 M1.75 M1.67 82.82,59.69 70.12,59.69 M1.56
  Bottom Layer w0.254: M3.8 35.19,27.94 34.81,28.32 34.81,36.45 v1(51.7,53.34) ; M1.56 M1.12
INT1: length 68.2
  Top Layer w0.254: M1.41 87.9,39.37 87.9,41.91 84.98,44.83 44.34,44.83 35.83,53.34 H1.10
  Top Layer w0.762: M1.41 NOREF#17.1 89.17,34.82
INT2: length 42.5
  Top Layer w0.254: M1.34 67.71,41.78 39.77,41.78 35.83,45.72 H1.16
MIDI_RX: length 43.3
  Top Layer w0.254: M1.38 81.55,34.29 79.01,31.75 68.21,31.75 66.31,29.84 66.31,25.4 63.77,22.86 R2.1
  Top Layer w0.381: U1.6 73.39,18.13 63.74,18.13
MIDI_TX: length 46.3
  Top Layer w0.254: U2.2 74.85,79.91 73.93,78.99 v1(73.93,77.47)
  Bottom Layer w0.254: v1(73.93,77.47) 73.93,74.04 77.74,70.23 77.74,39.37 M1.37
SPARE1: length 55
  Top Layer w0.254: 61.22,58.42 60.95,58.42 ; 61.22,58.42 61.5,58.42 ; 61.22,58.42 61.23,58.42 61.23,58.7 ; 60.95,58.42 H1.6 ; 60.95,58.42 61.23,58.7 ; 61.23,58.7 61.5,58.42 ; 61.23,58.7 M1.59 M1.15 ; 61.5,58.42 M1.71 M1.79
SPARE2: length 93.7
  Top Layer w0.254: H1.8 35.83,55.88 45.61,46.1 v1(63.78,46.1) 88.41,46.1 94.38,52.07 94.38,53.21 M1.73 94.25,54.61 91.71,57.15 M1.64
  Bottom Layer w0.254: v1(63.78,46.1) 63.78,63.49 M1.14
$1N8448: length 32.8
  Bottom Layer w0.381: D1.2 81.04,4.44 78.63,6.86 78.63,15.62 ; 78.63,15.62 78.63,15.62 U1.2 ; 78.63,15.62 78.63,22.48 75.07,26.03 R1.1
$1N8617: length 2.1
  Top Layer w0.381: U2.4 R4.1
$1N9304: length 6.2
  Bottom Layer w0.381: CN1.4 82.82,22.22 81.04,24 R1.2
$1N9313: length 12.4
  Bottom Layer w0.381: D1.1 82.58,10.35 CN1.2 84.45,16.28 82.56,18.16 U1.3
$1N9335: length 2.9
  Top Layer w0.381: CN2.4 81.51,86.97
$1N9340: length 2.9
  Top Layer w0.381: CN2.2 81.51,76.97
$1N10058: length 23.9
  Top Layer w0.254: M3.11 28.87,25.5 49.14,25.5 50.43,26.8
$1N10064: length 6.2
  Top Layer w0.254: M4.5 38.88,15.49 38.88,17.78 40.27,19.18
$1N10608: length 56.1
  Top Layer w0.381: CN3.3 5.73,66.01 5.73,57.46 7.33,55.87 16.78,55.87 ; 17.19,55.46 J1.6 ; 17.19,55.46 16.78,55.87 ; 17.19,55.46 17.19,56.35 ; 17.18,70.19 17.19,55.86 17.18,55.87 16.78,55.87 ; 16.78,55.87 17.19,56.27 ; J1.7 19.78,70.19 21.35,71.75 21.35,74.3 28.59,81.53
$1N10635: length 49.6
  Top Layer w0.381: 28.59,86.61 17.2,86.61 ; 17.2,86.61 17.2,90.47 ; 17.2,86.61 17.2,74.27 ; 17.2,74.27 15.96,74.27 14.24,72.55 14.24,66.97 13.29,66.02 11.67,66.02 11.67,58.94 11.14,58.41 9.98,58.41 9.97,58.42 ; 17.2,74.27 17.96,74.27
$1N57894: length 3.5
  Top Layer w0.762: 89.17,67.03 NOREF#7.1 M1.4
$1N57899: length 3.2
  Top Layer w0.762: 51.07,34.92 NOREF#15.1 M1.26
$1N57905: length 3.3
  Top Layer w0.762: 91.71,34.82 NOREF#9.1 M1.42
$1N58212: length 13.6
  Top Layer w0.508: NOREF#10.1 92.98,65.15 92.98,62.23 M1.47
  Top Layer w0.762: NOREF#10.1 94.25,67.03
  Bottom Layer w0.508: NOREF#10.1 92.98,65.15 92.98,62.23 M1.47
$1N58220: length 6.1
  Top Layer w0.762: M1.44 96.79,33.53 97.3,33.02 NOREF#13.2
$1N58226: length 6.1
  Top Layer w0.762: NOREF#6.2 94.76,33.02 94.25,33.53 M1.43
$1N59131: length 3.5
  Top Layer w0.762: M1.5 86.63,67
$1N59137: length 13.7
  Top Layer w0.508: M1.48 90.44,62.27 90.44,65.15 NOREF#2.1
  Top Layer w0.762: NOREF#2.1 91.71,67.03
  Bottom Layer w0.508: M1.48 90.44,62.27 90.44,65.15 NOREF#2.1

## Copper pours and planes (outline as drawn; the poured copper is in the pictures)
GND on Top Layer: 0.27,99.06 99.33,99.06 99.33,0 0.27,0
GND on Bottom Layer: 0.27,99.06 99.33,99.06 99.33,0 0.27,0
$1N10635 on Top Layer: 17.2,87.35 17.92,87.35 17.92,85.91 17.2,85.91

## Text on the board
Bottom Silkscreen Layer: ESP32-S3-WROOM 44PIN | ESP32-WROOM 38PIN | ESP32-WROOM 30PIN | ESP32-S2-MINI | ESP32-C6 | ESP32-S3/H2 | ESP32-C3 | SUPER MINI BOARDS
Top Silkscreen Layer: S3-WROOM | S2 | SUPER MINI BOARDS | C3 | H2 | S3 | C6 | ESP32-30PIN | ESP32-38PIN | J5: 3V3 | J8: +5V | J10: GND | J14: GND | J15: +5V | J14: +5V | J15: GND | J7: 3V3 | J9: +5V | J11: GND | J13: GND | J6: 3V3 | J12: GND | GND | +5V | JUMPER SETTINGS | AUDIO IN | AUDIO OUT | ADC MODULE | PCM1808 | MIDI OUT | MIDI IN | DAC MODULE | PCM5102
